# EAGLE schematic T11-MIDITheremin (EAGLE 7.7.0)
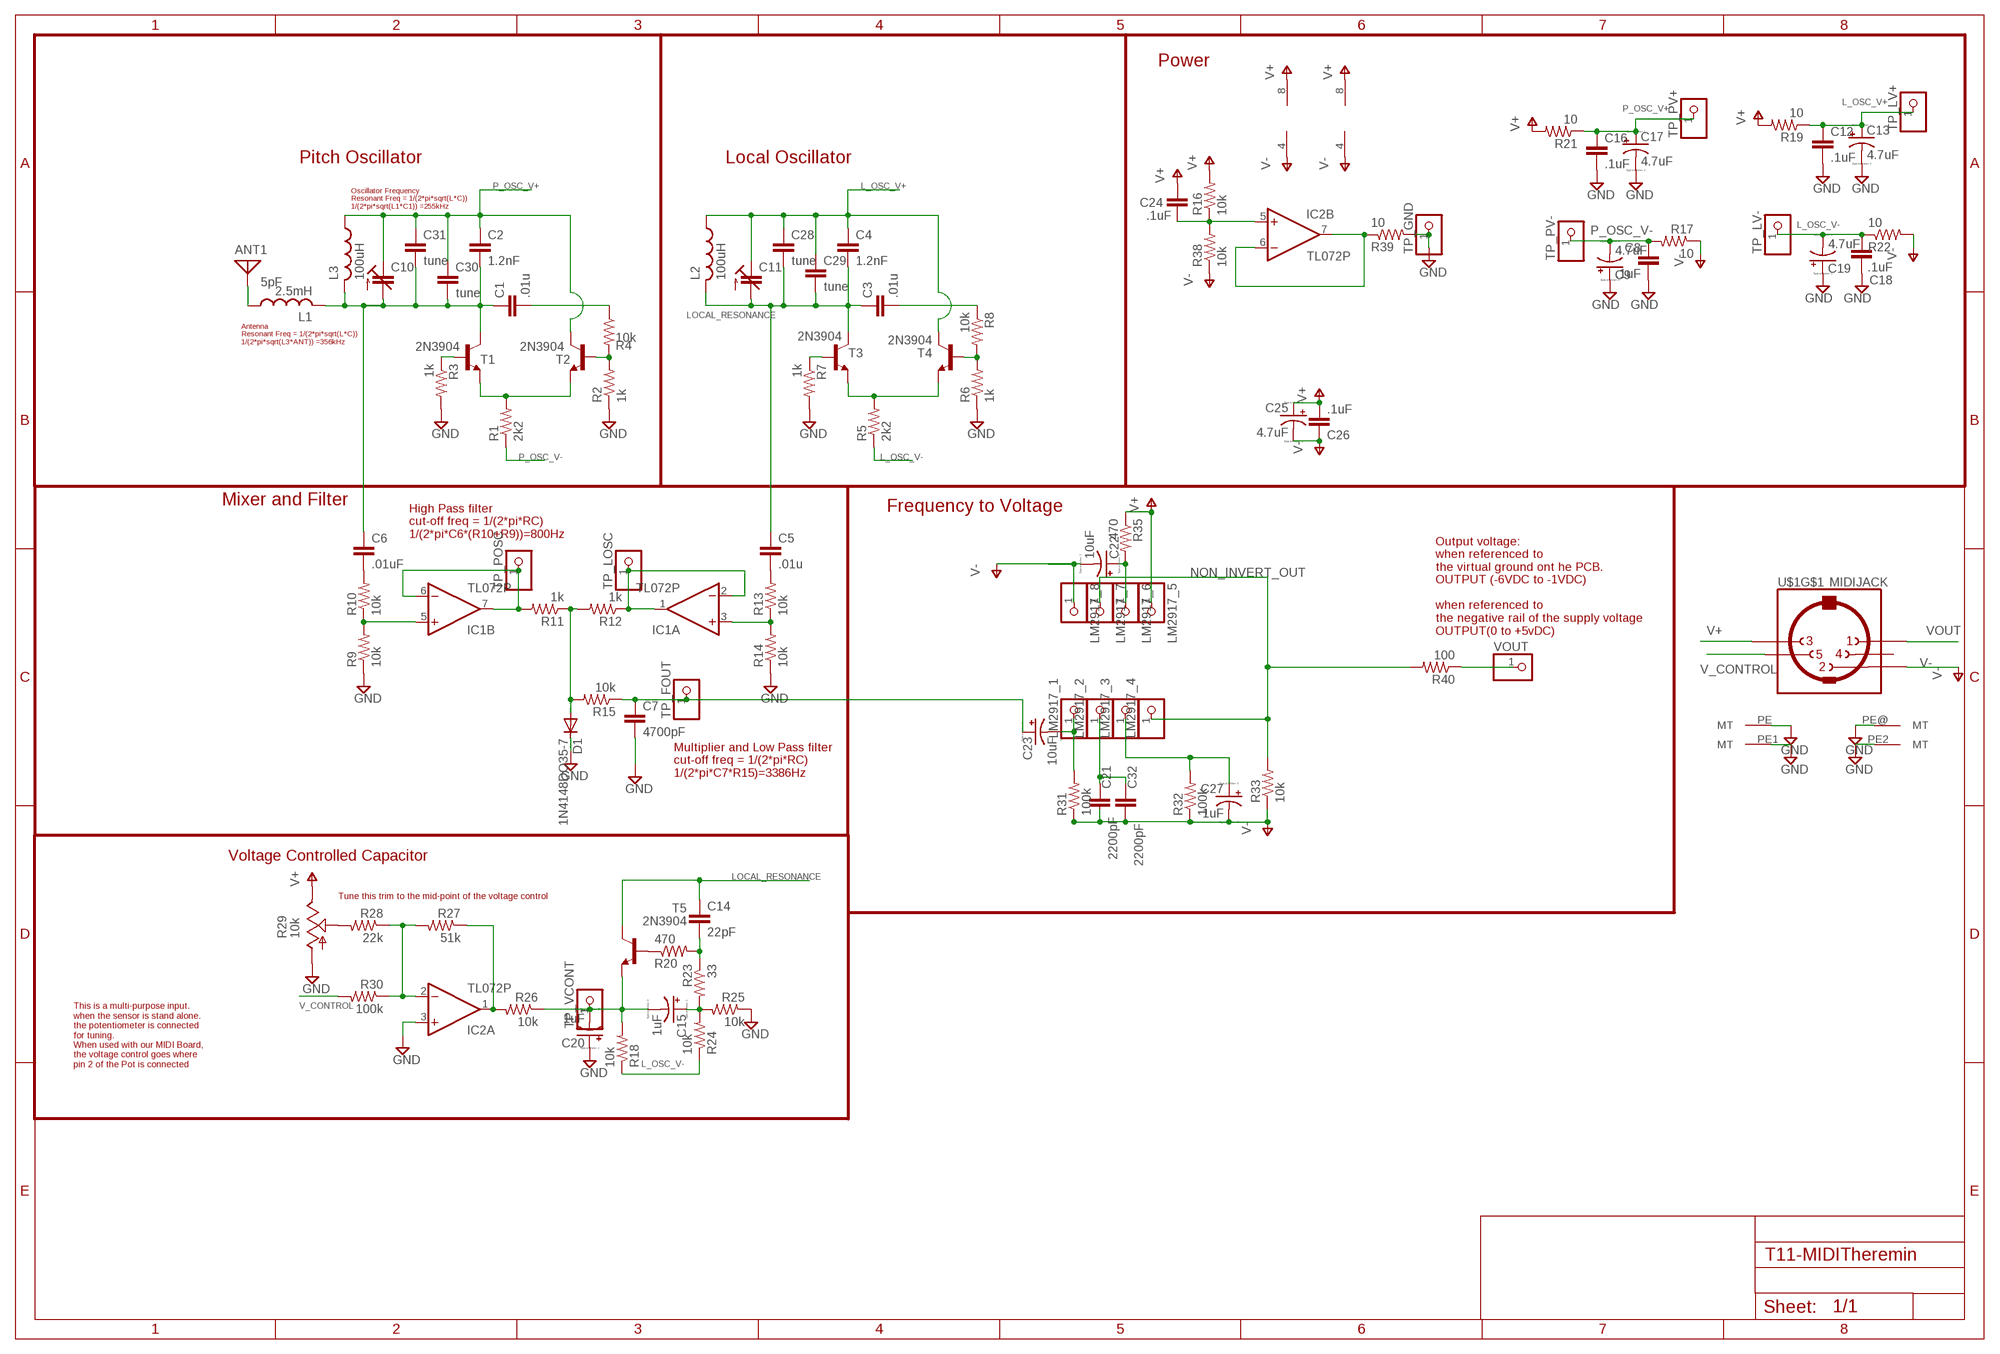
[diagram p0: schematic, sheet 1]

## Parts
ANT1  5pF  ANTENNA  [PAD-01]
C1  .01u  C-EU050-025X075  [C050-025X075]
C2  1.2nF  C-EU050-025X075  [C050-025X075]
C3  .01u  C-EU050-025X075  [C050-025X075]
C4  1.2nF  C-EU050-025X075  [C050-025X075]
C5  .01u  C-EU050-025X075  [C050-025X075]
C6  .01uF  C-EU050-025X075  [C050-025X075]
C7  4700pF  C-EU050-025X075  [C050-025X075]
C8  .1uF  C-EU050-025X075  [C050-025X075]
C9  4.7uF  CPOL-USE2.5-7  [E2,5-7]
C10  C-TRIMM3040.427  [CTRIM3040.427]
C11  C-TRIMM3040.427  [CTRIM3040.427]
C12  .1uF  C-EU050-025X075  [C050-025X075]
C13  4.7uF  CPOL-USE2.5-7  [E2,5-7]
C14  22pF  C-EU050-025X075  [C050-025X075]
C15  1uF  CPOL-USE2.5-7  [E2,5-7]
C16  .1uF  C-EU050-025X075  [C050-025X075]
C17  4.7uF  CPOL-USE2.5-7  [E2,5-7]
C18  .1uF  C-EU050-025X075  [C050-025X075]
C19  4.7uF  CPOL-USE2.5-7  [E2,5-7]
C20  1uF  CPOL-USE2.5-7  [E2,5-7]
C21  2200pF  C-EU050-025X075  [C050-025X075]
C22  10uF  CPOL-USE2.5-7  [E2,5-7]
C23  10uF  CPOL-USE2.5-7  [E2,5-7]
C24  .1uF  C-EU050-025X075  [C050-025X075]
C25  4.7uF  CPOL-USE2.5-7  [E2,5-7]
C26  .1uF  C-EU050-025X075  [C050-025X075]
C27  1uF  CPOL-USE2.5-7  [E2,5-7]
C28  tune  C-EU050-025X075  [C050-025X075]
C29  tune  C-EU050-025X075  [C050-025X075]
C30  tune  C-EU050-025X075  [C050-025X075]
C31  tune  C-EU050-025X075  [C050-025X075]
C32  2200pF  C-EU050-025X075  [C050-025X075]
D1  1N4148DO35-7  [DO35-7]
IC1  TL072P  [DIL08]
IC2  TL072P  [DIL08]
L1  2.5mH  L-US0207/5V  [0207/5V]
L2  100uH  L-US0207/5V  [0207/5V]
L3  100uH  L-US0207/5V  [0207/5V]
LM2917_1  PINHD-1X1  [1X01]
LM2917_2  PINHD-1X1  [1X01]
LM2917_3  PINHD-1X1  [1X01]
LM2917_4  PINHD-1X1  [1X01]
LM2917_5  PINHD-1X1  [1X01]
LM2917_6  PINHD-1X1  [1X01]
LM2917_7  PINHD-1X1  [1X01]
LM2917_8  PINHD-1X1  [1X01]
R1  2k2  R-US_0411/3V  [0411V]
R2  1k  R-US_0411/3V  [0411V]
R3  1k  R-US_0411/3V  [0411V]
R4  10k  R-US_0411/3V  [0411V]
R5  2k2  R-US_0411/3V  [0411V]
R6  1k  R-US_0411/3V  [0411V]
R7  1k  R-US_0411/3V  [0411V]
R8  10k  R-US_0411/3V  [0411V]
R9  10k  R-US_0411/3V  [0411V]
R10  10k  R-US_0411/3V  [0411V]
R11  1k  R-US_0411/3V  [0411V]
R12  1k  R-US_0411/3V  [0411V]
R13  10k  R-US_0411/3V  [0411V]
R14  10k  R-US_0411/3V  [0411V]
R15  10k  R-US_0411/3V  [0411V]
R16  10k  R-US_0411/3V  [0411V]
R17  10  R-US_0411/3V  [0411V]
R18  10k  R-US_0411/3V  [0411V]
R19  10  R-US_0411/3V  [0411V]
R20  470  R-US_0411/3V  [0411V]
R21  10  R-US_0411/3V  [0411V]
R22  10  R-US_0411/3V  [0411V]
R23  33  R-US_0411/3V  [0411V]
R24  10k  R-US_0411/3V  [0411V]
R25  10k  R-US_0411/3V  [0411V]
R26  10k  R-US_0411/3V  [0411V]
R27  51k  R-US_0411/3V  [0411V]
R28  22k  R-US_0411/3V  [0411V]
R29  10k  TRIM_US-B64Y  [B64Y]
R30  100k  R-US_0411/3V  [0411V]
R31  100k  R-US_0411/3V  [0411V]
R32  100k  R-US_0411/3V  [0411V]
R33  10k  R-US_0411/3V  [0411V]
R35  470  R-US_0411/3V  [0411V]
R38  10k  R-US_0411/3V  [0411V]
R39  10  R-US_0411/3V  [0411V]
R40  100  R-US_0411/3V  [0411V]
T1  2N3904  [TO92]
T2  2N3904  [TO92]
T3  2N3904  [TO92]
T4  2N3904  [TO92]
T5  2N3904  [TO92]
TP_FOUT  PINHD-1X1  [1X01]
TP_GND  PINHD-1X1  [1X01]
TP_LOSC  PINHD-1X1  [1X01]
TP_LV+  PINHD-1X1  [1X01]
TP_LV-  PINHD-1X1  [1X01]
TP_POSC  PINHD-1X1  [1X01]
TP_PV+  PINHD-1X1  [1X01]
TP_PV-  PINHD-1X1  [1X01]
TP_VCONT  PINHD-1X1  [1X01]
U$1  MIDIJACK  [CP-2350]
VOUT  PINHD-1X1  [1X01]

## Nets
GND: C7.2 C8.2 C9.+ C12.2 C13.- C16.2 C17.- C18.2 C19.+ C20.+ D1.C IC2.3(A:+IN) R2.1 R3.2 R6.1 R7.2 R9.1 R14.1 R25.1 R29.A R39.2 TP_GND.1 U$1.PE1(MT) U$1.PE2(MT) U$1.PE(MT) U$1.PE@(MT)
L_OSC_V+: C4.1 C11.1A(E) C12.1 C13.+ C28.1 C29.1 L2.1 R19.1 T4.1(C) TP_LV+.1
L_OSC_V-: C18.1 C19.- R5.1 R18.1 R22.1 R24.1 TP_LV-.1
LOCAL_RESONANCE: C3.1 C4.2 C5.1 C11.2(A) C14.1 C28.2 C29.2 L2.2 T3.1(C) T5.1(C)
N$1: R1.2 T1.3(E) T2.3(E)
N$2: R2.2 R4.2 T2.2(B)
N$3: R3.1 T1.2(B)
N$4: C1.1 C2.2 C6.1 C10.2(A) C30.2 C31.2 L1.2 L3.2 T1.1(C)
N$5: C1.2 R4.1
N$6: R5.2 T3.3(E) T4.3(E)
N$7: R6.2 R8.2 T4.2(B)
N$8: R7.1 T3.2(B)
N$9: C15.- C20.- R18.2 R26.1 T5.3(E) TP_VCONT.1
N$10: C5.2 R13.2
N$11: IC1.6(B:-IN) IC1.7(B:OUT) R11.2 TP_POSC.1
N$12: IC1.1(A:OUT) IC1.2(A:-IN) R12.1 TP_LOSC.1
N$13: IC1.5(B:+IN) R9.2 R10.1
N$14: D1.A R11.1 R12.2 R15.2
N$15: IC1.3(A:+IN) R13.1 R14.2
N$16: C3.2 R8.1
N$17: C6.2 R10.2
N$18: C7.1 C23.+ R15.1 TP_FOUT.1
N$20: C21.1 C32.1 LM2917_2.1
N$21: R20.1 T5.2(B)
N$22: C14.2 R20.2 R23.1
N$23: C15.+ R23.2 R24.2 R25.2
N$24: IC2.1(A:OUT) R26.2 R27.1
N$25: IC2.2(A:-IN) R27.2 R28.1 R30.1
N$26: R28.2 R29.S
N$27: IC2.6(B:-IN) IC2.7(B:OUT) R39.1
N$28: ANT1.1 L1.1
N$31: C22.+ LM2917_6.1 R35.2
N$33: C27.+ LM2917_3.1 R32.2
N$34: C23.- LM2917_1.1 R31.2
N$36: C24.2 IC2.5(B:+IN) R16.1 R38.2
NON_INVERT_OUT: LM2917_4.1 LM2917_7.1 R33.2 R40.2
P_OSC_V+: C2.1 C10.1A(E) C16.1 C17.+ C30.1 C31.1 L3.1 R21.1 T2.1(C) TP_PV+.1
P_OSC_V-: C8.1 C9.- R1.1 R17.2 TP_PV-.1
V+: C24.1 C25.+ C26.2 IC1.8(P:V+) IC2.8(P:V+) LM2917_5.1 R16.2 R19.2 R21.2 R29.E R35.1 U$1.3
V-: C21.2 C22.- C25.- C26.1 C27.- C32.2 IC1.4(P:V-) IC2.4(P:V-) LM2917_8.1 R17.1 R22.2 R31.1 R32.1 R33.1 R38.1 U$1.2
V_CONTROL: R30.2 U$1.5
VOUT: R40.1 U$1.1 VOUT.1
Unconnected: U$1.4

## Notes on the sheet
- Power
- Pitch Oscillator | Local Oscillator
- Oscillator Frequency
  Resonant Freq = 1/(2*pi*sqrt(L*C)) 
  1/(2*pi*sqrt(L1*C1)) =255kHz
- Antenna
  Resonant Freq = 1/(2*pi*sqrt(L*C)) 
  1/(2*pi*sqrt(L3*ANT)) =356kHz
- Mixer and Filter
- Frequency to Voltage
- High Pass filter
  cut-off freq = 1/(2*pi*RC) 
  1/(2*pi*C6*(R10+R9))=800Hz
- Output voltage: 
  when referenced to 
  the virtual ground ont he PCB.
  OUTPUT (-6VDC to -1VDC)
  
  when referenced to 
  the negative rail of the supply voltage
  OUTPUT(0 to +5vDC)
- Multiplier and Low Pass filter
  cut-off freq = 1/(2*pi*RC) 
  1/(2*pi*C7*R15)=3386Hz
- Voltage Controlled Capacitor
- Tune this trim to the mid-point of the voltage control
- This is a multi-purpose input.
  when the sensor is stand alone.
  the potentiometer is connected 
  for tuning. 
  When used with our MIDI Board, 
  the voltage control goes where
  pin 2 of the Pot is connected

## Library data of the parts
ANT1 = discrete:ANTENNA: Antenna
C1-C8 C12 C14 C16 C18 C21 C24 C26 C28-C32 = resistor:C-EU: CAPACITOR, European symbol
C9 C13 C15 C17 C19 C20 C22 C23 C25 C27 = resistor:CPOL-US: POLARIZED CAPACITOR, American symbol
C10 C11 = rcl:C-TRIMM: Trimm capacitor
D1 = diode:1N4148: DIODE high speed (Philips)
IC1 IC2 = linear:TL072: OP AMP
L1-L3 = resistor:L-US: INDUCTOR, American symbol
LM2917_1-LM2917_8 TP_FOUT TP_GND TP_LOSC TP_LV+ TP_LV- TP_POSC TP_PV+ TP_PV- TP_VCONT VOUT = pinhead:PINHD-1X1: PIN HEADER
R1-R28 R30 R38 R39 = resistor:R-US_: RESISTOR, American symbol
R29 = pot:TRIM_US-: POTENTIOMETER
R31-R33 R35 R40 = rcl:R-US_: RESISTOR, American symbol
T1-T5 = transistor-neu-to92:2N3904: NPN TRANSISTOR
U$1 = adafruit:MIDIJACK: DIN 5 jack also known as MIDI jack A modification of conn-hirshman:MAB5SH with two options for the grounding 'teeth'